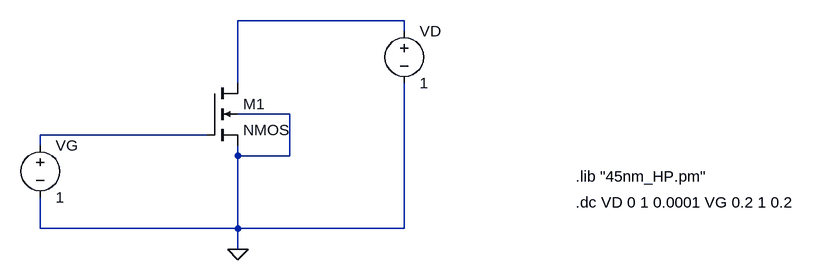
[diagram p0: schematic 45n_IDVD.asc]
45n_IDVD.asc, the LTspice schematic file:
Version 4
SHEET 1 1116 680
WIRE 496 0 240 0
WIRE 496 16 496 0
WIRE 240 96 240 0
WIRE 320 144 240 144
WIRE 192 176 -64 176
WIRE -64 192 -64 176
WIRE 240 208 240 192
WIRE 320 208 320 144
WIRE 320 208 240 208
WIRE -64 320 -64 272
WIRE 240 320 240 208
WIRE 240 320 -64 320
WIRE 496 320 496 96
WIRE 496 320 240 320
WIRE 240 352 240 320
FLAG 240 352 0
SYMBOL nmos4 192 96 R0
SYMATTR InstName M1
SYMATTR Value2 l=45n w=90n
SYMBOL voltage -64 176 R0
SYMATTR InstName VG
SYMATTR Value 1
SYMBOL voltage 496 0 R0
WINDOW 123 0 0 Left 0
WINDOW 39 0 0 Left 0
SYMATTR InstName VD
SYMATTR Value 1
TEXT 760 240 Left 2 !.lib "45nm_HP.pm"
TEXT 760 280 Left 2 !.dc VD 0 1 0.0001 VG 0.2 1 0.2

The netlist it stands for:
* 45n_IDVD.asc
M1 N001 N002 0 0 NMOS l=45n w=90n
VG N002 0 1
VD N001 0 1
.model NMOS NMOS
.model PMOS PMOS
.lib standard.mos
.lib "45nm_HP.pm"
.dc VD 0 1 0.0001 VG 0.2 1 0.2
.backanno
.end